# EAGLE design Power (EAGLE 9.4.1)
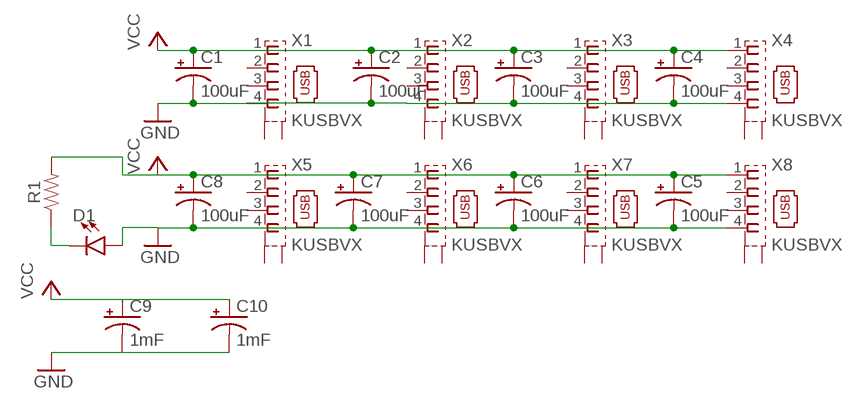
[diagram p0: schematic, sheet 1]

## Parts
C1  100uF  100UF-POLAR-RADIAL-2.5MM-25V-20%  [CPOL-RADIAL-2.5MM-6.5MM]
C2  100uF  100UF-POLAR-RADIAL-2.5MM-25V-20%  [CPOL-RADIAL-2.5MM-6.5MM]
C3  100uF  100UF-POLAR-RADIAL-2.5MM-25V-20%  [CPOL-RADIAL-2.5MM-6.5MM]
C4  100uF  100UF-POLAR-RADIAL-2.5MM-25V-20%  [CPOL-RADIAL-2.5MM-6.5MM]
C5  100uF  100UF-POLAR-RADIAL-2.5MM-25V-20%  [CPOL-RADIAL-2.5MM-6.5MM]
C6  100uF  100UF-POLAR-RADIAL-2.5MM-25V-20%  [CPOL-RADIAL-2.5MM-6.5MM]
C7  100uF  100UF-POLAR-RADIAL-2.5MM-25V-20%  [CPOL-RADIAL-2.5MM-6.5MM]
C8  100uF  100UF-POLAR-RADIAL-2.5MM-25V-20%  [CPOL-RADIAL-2.5MM-6.5MM]
C9  1mF  1000UF-RADIAL-5MM-25V-20%  [CPOL-RADIAL-5MM-10MM]
C10  1mF  1000UF-RADIAL-5MM-25V-20%  [CPOL-RADIAL-5MM-10MM]
D1  LED3MM  [LED_3MM]
R1  RESISTORAXIAL-0.3  [AXIAL-0.3]
X1  KUSBVX  [KUSBVX]
X2  KUSBVX  [KUSBVX]
X3  KUSBVX  [KUSBVX]
X4  KUSBVX  [KUSBVX]
X5  KUSBVX  [KUSBVX]
X6  KUSBVX  [KUSBVX]
X7  KUSBVX  [KUSBVX]
X8  KUSBVX  [KUSBVX]

## Nets
GND: C1.2(-) C2.2(-) C3.2(-) C4.2(-) C5.2(-) C6.2(-) C7.2(-) C8.2(-) C9.- C10.- D1.A X1.4 X2.4 X3.4 X4.4 X5.4 X6.4 X7.4 X8.4
N$2: D1.K(C) R1.P$1
VCC: C1.1(+) C2.1(+) C3.1(+) C4.1(+) C5.1(+) C6.1(+) C7.1(+) C8.1(+) C9.+ C10.+ R1.P$2 X1.1 X2.1 X3.1 X4.1 X5.1 X6.1 X7.1 X8.1
Unconnected: X1.2 X1.3 X1.M1(S1) X1.M2(S2) X2.2 X2.3 X2.M1(S1) X2.M2(S2) X3.2 X3.3 X3.M1(S1) X3.M2(S2) X4.2 X4.3 X4.M1(S1) X4.M2(S2) X5.2 X5.3 X5.M1(S1) X5.M2(S2) X6.2 X6.3 X6.M1(S1) X6.M2(S2) X7.2 X7.3 X7.M1(S1) X7.M2(S2) X8.2 X8.3 X8.M1(S1) X8.M2(S2)

## Library data of the parts
C1-C8 = SparkFun-Capacitors:100UF-POLAR: 100µF polarized capacitors A capacitor is a passive two-terminal electrical component used to store electrical energy temporarily in an electric field.; PROD_ID: CAP-08439
C9 C10 = SparkFun-Capacitors:1000UF: 1,000µF/1mF ceramic capacitors A capacitor is a passive two-terminal electrical component used to store electrical energy temporarily in an electric field. CAP-08070; PROD_ID: CAP-09538
D1 = SparkFun-LED:LED: LED (Generic) Standard schematic elements and footprints for 5mm, 3mm, 1206, and 0603 sized LEDs. Generic LEDs with no color specified.; PROD_ID: DIO-08794
R1 = SparkFun-Resistors:RESISTOR: Generic Resistor Package
X1-X8 = con-kycon:KUSBVX: Vertical,Top Entry Universal Serial Bus Connector KUSBVX Series Source: KYCON Sibalco USB vertical socket KUSBV.pdf

## Board
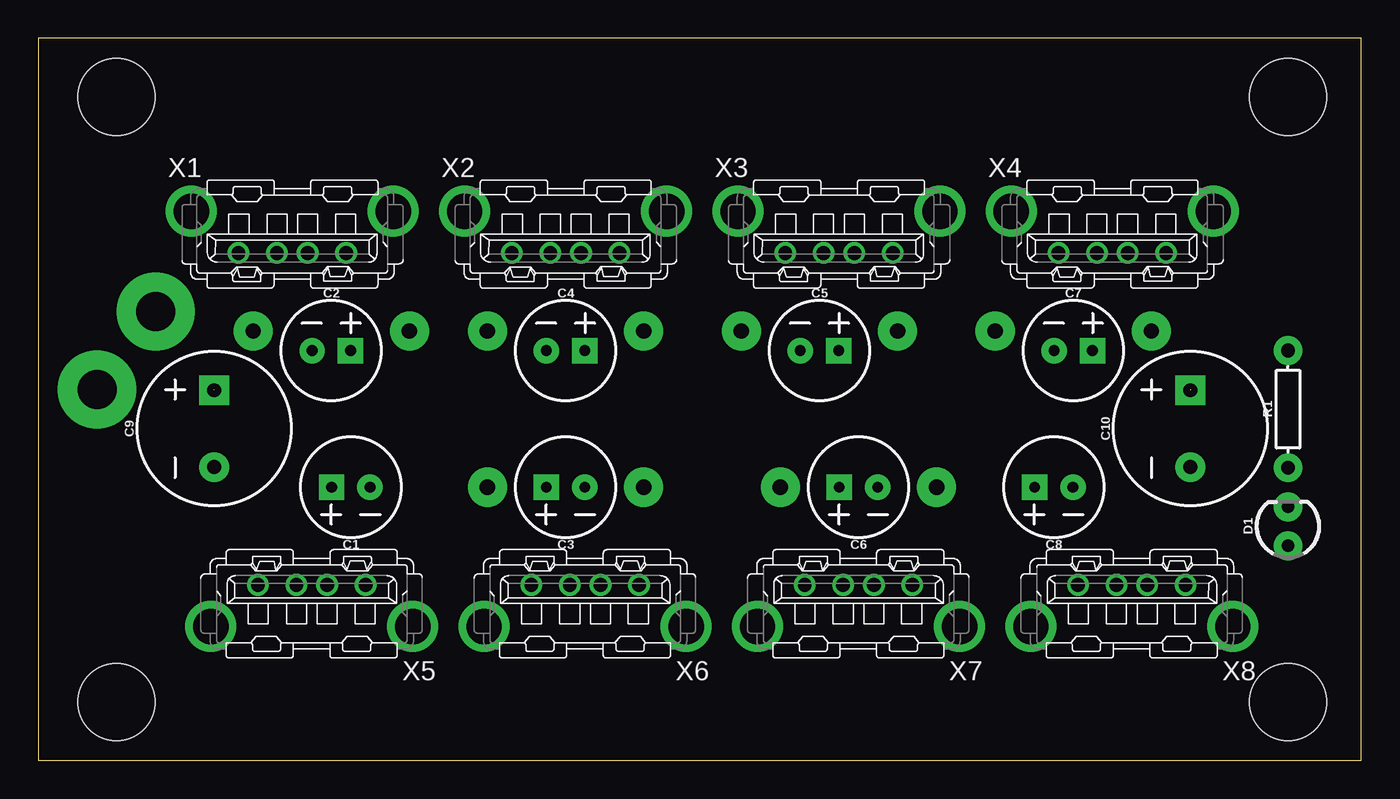
[diagram p1: board, top side]
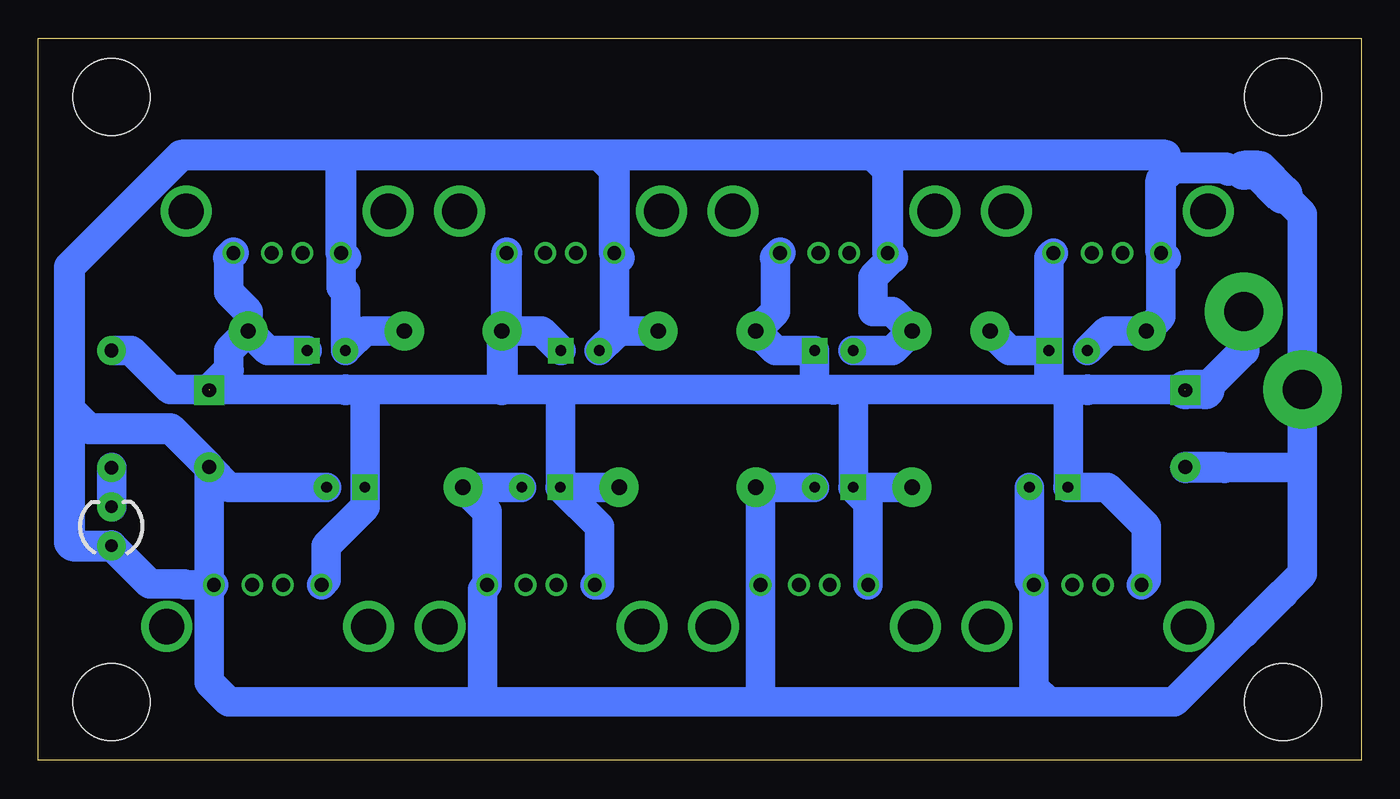
[diagram p2: board, bottom side, seen from below]

Size 86.03 x 46.98 mm. Coordinates in mm from the lower left corner, seen from the top.
Outline: 0,0 86.03,0 86.03,46.98 0,46.98 0,0
Copper layers (1*16): Top 0.035mm / dielectric 1.5mm / Bottom 0.035mm
Design rules "default": minimum track width 6mil, minimum drill 0.35mm, track to track 6mil, track to pad 6mil, pad to pad 6mil, via to via 6mil, smd to smd 6mil, copper to edge 40mil, drill to drill 6mil, minimum pad ring 10mil, minimum via ring 8mil, stop-mask expansion 4mil, vias tented up to drill 0mil, thermal gap 10mil
Holes 5 mm at 5.08,3.81 5.08,43.18 81.28,3.81 81.28,43.18

### Footprints (pad centres in the part's own frame; a part is rotated, then mirrored left to right if it is on the bottom)
CPOL-RADIAL-2.5MM-6.5MM = drill 0.7 pad 1.651 square: 1 1.25,0 | drill 0.7 pad 1.651: 2 -1.25,0
CPOL-RADIAL-5MM-10MM = drill 0.9 pad 1.93 square: + 2.5,0 | drill 0.9 pad 1.93: - -2.5,0
LED_3MM = drill 0.813 pad 1.88: A -1.27,0; K 1.27,0
AXIAL-0.3 = drill 0.9 pad 1.88: P$1 -3.81,0; P$2 3.81,0
KUSBVX = drill 0.9 pad 1.3: 1 3.5,0; 2 1,0; 3 -1,0; 4 -3.5,0 | drill 2.3 pad 2.8: M1 -6.57,2.71; M2 6.57,2.71

### Placement (x,y rotation side)
C1  20.32,17.78 180 top
C2  19.05,26.67 0 top
C3  34.29,17.78 180 top
C4  34.29,26.67 0 top
C5  50.8,26.67 0 top
C6  53.34,17.78 180 top
C7  67.31,26.67 0 top
C8  66.04,17.78 180 top
C9  11.43,21.59 90 top
C10  74.93,21.59 90 top
D1  81.28,15.24 90 top
R1  81.28,22.86 90 top
X1  16.51,33.02 0 top
X2  34.29,33.02 0 top
X3  52.07,33.02 0 top
X4  69.85,33.02 0 top
X5  17.78,11.43 180 top
X6  35.56,11.43 180 top
X7  53.34,11.43 180 top
X8  71.12,11.43 180 top

### Tracks (layer width: path | path; a pad name or v marks a point on that pad's centre or on a via)
GND  (via drill 1 pad 2.54, 2.54 pad 5.08)
  Bottom 1.905: X4.4 66.35,30.79 66.04,30.48 66.04,26.69 | 66.04,26.69 C7.2 | v62.23,27.94 64.79,27.94 66.04,26.69 | C5.2 48.57,27.65 | 48.57,27.65 X3.4 | 48.57,27.65 48.28,27.94 v45.72,27.94 | C4.2 30.48,26.67 v29.21,27.94 30.48,29.21 31.75,29.21 31.75,31.44 30.48,32.71 | X1.4 13.01,28.9 v13.97,27.94 16.53,27.94 C2.2 | C1.2 21.57,11.72 X5.4 21.28,4.77 20.32,3.81 | 20.32,3.81 12.14,3.81 7.62,8.33 | 20.32,3.81 39.37,3.81 | 39.37,3.81 57.15,3.81 | 57.15,3.81 73.66,3.81 74.93,5.08 74.93,7.57 74.93,7.58 74.93,9.86 74.93,9.87 74.93,11.12 X8.4 74.93,11.43 | 74.93,11.43 76.49,11.43 76.55,11.48 78.79,11.48 D1.A | C8.2 73.62,17.78 C10.- 74.93,11.43 | 57.15,3.81 57.15,7.57 57.15,7.58 57.15,9.86 57.15,9.87 57.15,11.12 X7.4 56.84,16.2 v58.42,17.78 C6.2 | 39.37,3.81 39.06,4.12 X6.4 39.06,17.47 v39.37,17.78 C3.2 | 5.08,36.83 3.81,35.56 v3.81,24.13 3.81,19.05 | 3.81,19.05 8.89,19.05 | 3.81,19.05 3.81,12.14 5.08,10.87
  Bottom 2: 7.62,38.39 8.63,38.39 8.78,38.54 12.26,38.54 12.7,38.1 | 12.7,38.1 12.7,39.37 31.75,39.37 | 84.01,22.86 84.01,32.11 76.75,39.37 66.04,39.37 | 31.75,39.37 49.53,39.37 | 49.53,39.37 66.04,39.37 | 84.01,22.86 82.74,21.59 77.43,21.59 C10.- | 84.01,22.86 84.01,14.16 83.82,13.97 D1.A | 5.08,10.87 7.62,8.33 | 8.89,19.05 11.43,19.05 C9.- | 12.7,32.71 X1.4 13.01,37.79 12.7,38.1 | 30.48,32.71 X2.4 30.79,38.41 31.75,39.37 | 48.26,32.71 X3.4 48.57,38.41 49.53,39.37 | 66.04,32.71 X4.4 66.35,39.06 66.04,39.37
  Bottom 2.54: 5.08,36.83 6.64,38.39 7.62,38.39
N$2
  Bottom 1.905: D1.K R1.P$1
VCC  (via drill 1 pad 2.54, 2.54 pad 5.08)  (2 unrouted)
  Bottom 1.905: 64.77,24.13 66.04,24.13 74.93,24.13 77.47,24.13 80.01,26.67 R1.P$2 | 64.77,24.13 55.88,24.13 52.07,24.13 | 52.07,24.13 35.56,24.13 | 35.56,24.13 34.29,24.13 | 34.29,24.13 33.02,24.13 | 33.02,24.13 20.32,24.13 | 20.32,24.13 19.05,24.13 | 11.43,24.13 17.78,24.13 19.05,24.13 | 34.31,24.11 34.29,24.13 | 19.03,24.15 19.05,24.13 | C1.1 19.03,17.82 | C7.1 71.12,26.67 v72.39,27.94 | v72.39,27.94 73.66,26.67 73.66,25.4 | v72.39,27.94 72.39,29.21 73.66,30.48 73.66,32.71 | C5.1 53.32,27.94 v55.88,27.94 | 35.56,24.13 35.56,26.65 C4.1 38.1,26.67 v39.37,27.94 38.1,29.21 38.1,32.71 | C2.1 20.32,26.65 20.32,24.13 | C2.1 22.86,26.67 v24.13,27.94 | C2.1 20.3,32.73 X1.1 | C1.1 19.05,17.8 19.05,24.13 | X5.1 13.97,11.74 13.97,15.24 16.51,17.78 C1.1 | 64.77,24.13 64.77,17.8 C8.1 64.79,16.49 67.31,13.97 67.31,11.74 X8.1 | C6.1 52.07,17.8 52.07,24.13 | C6.1 v48.26,17.78 | C6.1 49.53,15.22 49.53,11.43 X7.1 | C3.1 33.02,17.8 33.02,24.13 | C3.1 v29.21,17.78 | C3.1 32.06,16.8 X6.1
  Bottom 2: 17.8,24.11 17.78,24.13 | 38.1,32.71 X2.1 | 55.88,24.13 v55.88,27.94 55.57,28.25 X3.1 | 73.66,25.4 74.93,24.13 | 73.66,32.71 X4.1 | 66.06,24.11 66.04,24.13 | v7.62,29.21 7.62,26.67 10.16,24.13
  Bottom 2.54: 10.16,24.13 11.43,24.13